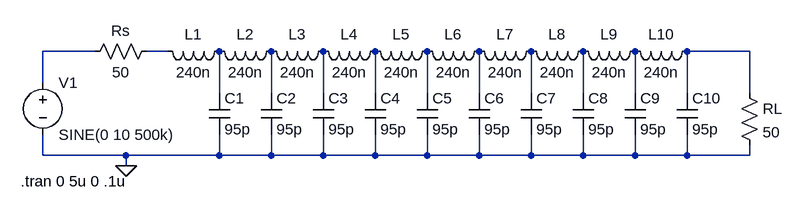
[diagram p0: schematic Lab2_Draft1.asc]
Lab2_Draft1.asc, the LTspice schematic file:
Version 4
SHEET 1 1304 680
WIRE 64 64 -16 64
WIRE 176 64 144 64
WIRE 1072 64 976 64
WIRE -16 112 -16 64
WIRE 256 128 256 64
WIRE 336 128 336 64
WIRE 416 128 416 64
WIRE 496 128 496 64
WIRE 576 128 576 64
WIRE 656 128 656 64
WIRE 736 128 736 64
WIRE 816 128 816 64
WIRE 896 128 896 64
WIRE 976 128 976 64
WIRE 1072 128 1072 64
WIRE -16 224 -16 192
WIRE 112 224 -16 224
WIRE 256 224 256 192
WIRE 256 224 112 224
WIRE 336 224 336 192
WIRE 336 224 256 224
WIRE 416 224 416 192
WIRE 416 224 336 224
WIRE 496 224 496 192
WIRE 496 224 416 224
WIRE 576 224 576 192
WIRE 576 224 496 224
WIRE 656 224 656 192
WIRE 656 224 576 224
WIRE 736 224 736 192
WIRE 736 224 656 224
WIRE 816 224 816 192
WIRE 816 224 736 224
WIRE 896 224 896 192
WIRE 896 224 816 224
WIRE 976 224 976 192
WIRE 976 224 896 224
WIRE 1072 224 1072 208
WIRE 1072 224 976 224
WIRE 112 240 112 224
FLAG 112 240 0
SYMBOL voltage -16 96 R0
WINDOW 123 0 0 Left 2
WINDOW 39 0 0 Left 2
SYMATTR InstName V1
SYMATTR Value SINE(0 10 500k)
SYMATTR Value2 ""
SYMATTR SpiceLine ""
SYMBOL res 160 48 R90
WINDOW 0 0 56 VBottom 2
WINDOW 3 32 56 VTop 2
SYMATTR InstName Rs
SYMATTR Value 50
SYMBOL ind 272 48 R90
WINDOW 0 5 56 VBottom 2
WINDOW 3 32 56 VTop 2
SYMATTR InstName L1
SYMATTR Value 240n
SYMBOL cap 240 128 R0
SYMATTR InstName C1
SYMATTR Value 95p
SYMBOL ind 352 48 R90
WINDOW 0 5 56 VBottom 2
WINDOW 3 32 56 VTop 2
SYMATTR InstName L2
SYMATTR Value 240n
SYMBOL cap 320 128 R0
SYMATTR InstName C2
SYMATTR Value 95p
SYMBOL ind 432 48 R90
WINDOW 0 5 56 VBottom 2
WINDOW 3 32 56 VTop 2
SYMATTR InstName L3
SYMATTR Value 240n
SYMBOL cap 400 128 R0
SYMATTR InstName C3
SYMATTR Value 95p
SYMBOL ind 512 48 R90
WINDOW 0 5 56 VBottom 2
WINDOW 3 32 56 VTop 2
SYMATTR InstName L4
SYMATTR Value 240n
SYMBOL cap 480 128 R0
SYMATTR InstName C4
SYMATTR Value 95p
SYMBOL ind 592 48 R90
WINDOW 0 5 56 VBottom 2
WINDOW 3 32 56 VTop 2
SYMATTR InstName L5
SYMATTR Value 240n
SYMBOL cap 560 128 R0
SYMATTR InstName C5
SYMATTR Value 95p
SYMBOL ind 672 48 R90
WINDOW 0 5 56 VBottom 2
WINDOW 3 32 56 VTop 2
SYMATTR InstName L6
SYMATTR Value 240n
SYMBOL cap 640 128 R0
SYMATTR InstName C6
SYMATTR Value 95p
SYMBOL ind 752 48 R90
WINDOW 0 5 56 VBottom 2
WINDOW 3 32 56 VTop 2
SYMATTR InstName L7
SYMATTR Value 240n
SYMBOL cap 720 128 R0
SYMATTR InstName C7
SYMATTR Value 95p
SYMBOL ind 832 48 R90
WINDOW 0 5 56 VBottom 2
WINDOW 3 32 56 VTop 2
SYMATTR InstName L8
SYMATTR Value 240n
SYMBOL cap 800 128 R0
SYMATTR InstName C8
SYMATTR Value 95p
SYMBOL ind 912 48 R90
WINDOW 0 5 56 VBottom 2
WINDOW 3 32 56 VTop 2
SYMATTR InstName L9
SYMATTR Value 240n
SYMBOL cap 880 128 R0
SYMATTR InstName C9
SYMATTR Value 95p
SYMBOL ind 992 48 R90
WINDOW 0 5 56 VBottom 2
WINDOW 3 32 56 VTop 2
SYMATTR InstName L10
SYMATTR Value 240n
SYMBOL cap 960 128 R0
SYMATTR InstName C10
SYMATTR Value 95p
SYMBOL res 1056 112 R0
SYMATTR InstName RL
SYMATTR Value 50
TEXT -50 264 Left 2 !.tran 0 5u 0 .1u

The netlist it stands for:
* Lab2_Draft1.asc
V1 N001 0 SINE(0 10 500k)
Rs N002 N001 50
L1 N004 N002 240n
C1 N004 0 95p
L2 N005 N004 240n
C2 N005 0 95p
L3 N006 N005 240n
C3 N006 0 95p
L4 N007 N006 240n
C4 N007 0 95p
L5 N008 N007 240n
C5 N008 0 95p
L6 N009 N008 240n
C6 N009 0 95p
L7 N010 N009 240n
C7 N010 0 95p
L8 N011 N010 240n
C8 N011 0 95p
L9 N012 N011 240n
C9 N012 0 95p
L10 N003 N012 240n
C10 N003 0 95p
RL N003 0 50
.tran 0 5u 0 .1u
.backanno
.end